# EAGLE design lightsaber (EAGLE 9.6.2)
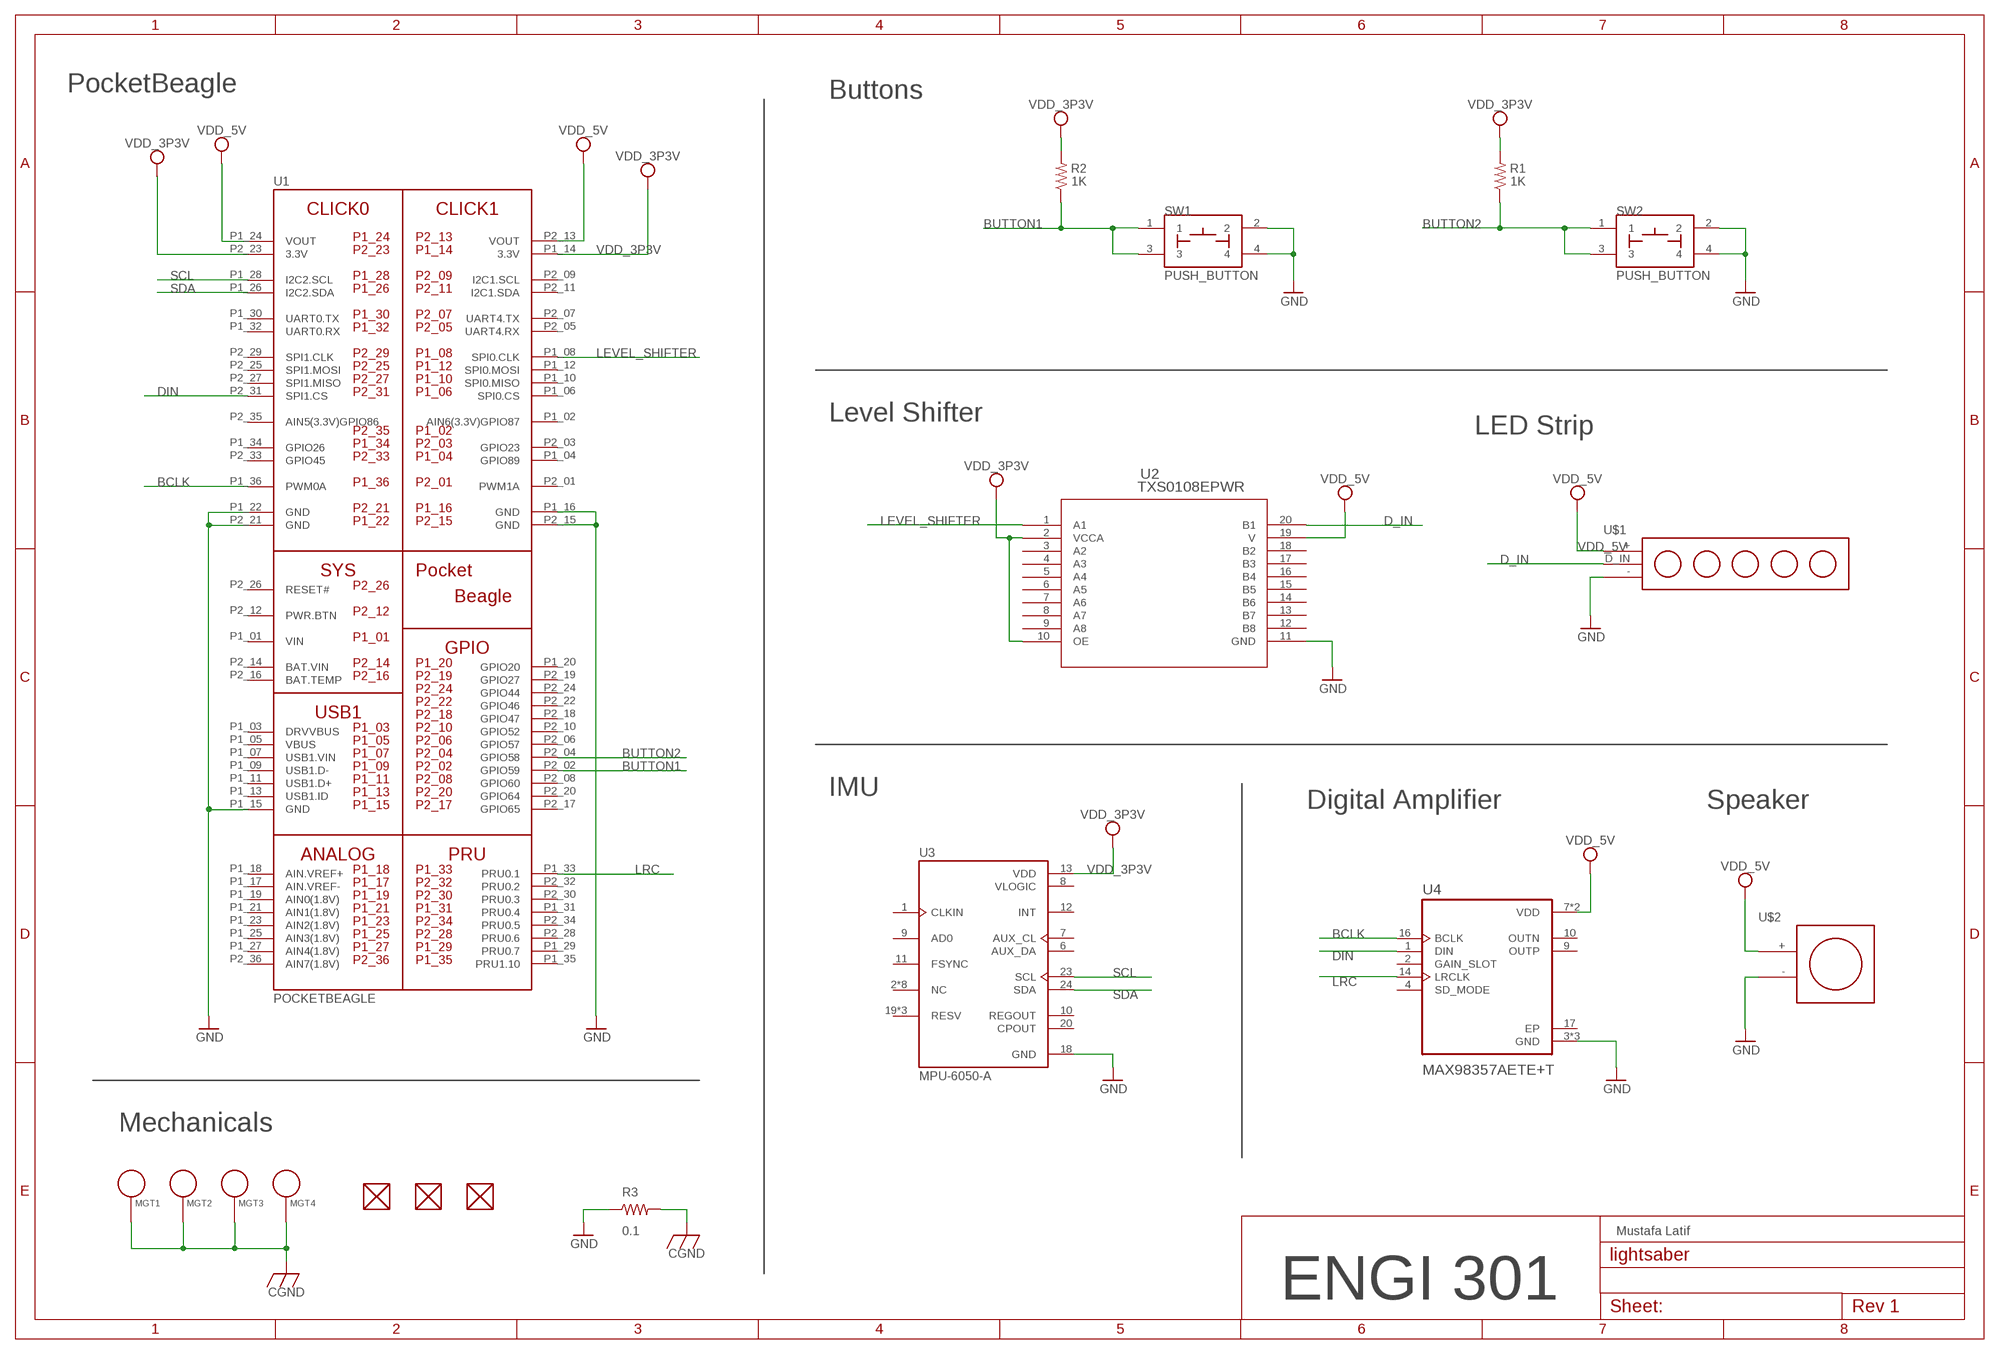
[diagram p0: schematic, sheet 1]

## Parts
FUD1  FIDUCIAL  [FIDUCIAL_40MIL]
FUD2  FIDUCIAL  [FIDUCIAL_40MIL]
FUD3  FIDUCIAL  [FIDUCIAL_40MIL]
MGT1  MOUNTING_HOLE  [MOUNTING_HOLE]
MGT2  MOUNTING_HOLE  [MOUNTING_HOLE]
MGT3  MOUNTING_HOLE  [MOUNTING_HOLE]
MGT4  MOUNTING_HOLE  [MOUNTING_HOLE]
R1  1K  R_R0603  [R0603]
R2  1K  R_R0603  [R0603]
R3  0.1  R_R0805  [R0805]
SW1  PUSH_BUTTON  [BUTTON_12.5MM]
SW2  PUSH_BUTTON  [BUTTON_12.5MM]
U1  POCKETBEAGLE  [POCKETBEAGLE]
U2  TXS0108EPWR  [PW20]
U3  MPU-6050-A  [QFN50P400X400X95-24N]
U4  MAX98357AETE+T  [QFN50P300X300X80-17N]
U$1  LED_LIGHT_STRIP  [LED_LIGHT_STRIP]
U$2  SPEAKER  [SPEAKER]

## Nets
BCLK: U1.P1_36(PWM0A) U4.16(BCLK)
BUTTON1: R2.1 SW1.1 SW1.3 U1.P2_02(GPIO59)
BUTTON2: R1.1 SW2.1 SW2.3 U1.P2_04(GPIO58)
CGND: MGT1.P$1 MGT2.P$1 MGT3.P$1 MGT4.P$1 R3.2
D_IN: U2.20(B1) U$1.D_IN
DIN: U1.P2_31(SPI1.CS) U4.1(DIN)
GND: R3.1 SW1.2 SW1.4 SW2.2 SW2.4 U1.P1_15(GND) U1.P1_16(GND) U1.P1_22(GND) U1.P2_15(GND) U1.P2_21(GND) U2.11(GND) U3.18(GND) U4.3(GND) U4.11(GND) U4.15(GND) U$1.-(GND) U$2.-
LEVEL_SHIFTER: U1.P1_08(SPI0.CLK) U2.1(A1)
LRC: U1.P1_33(PRU0.1) U4.14(LRCLK)
SCL: U1.P1_28(I2C2.SCL) U3.23(SCL)
SDA: U1.P1_26(I2C2.SDA) U3.24(SDA)
VDD_3P3V: R1.2 R2.2 U1.P1_14(3.3V) U1.P2_23(3.3V) U2.2(VCCA) U2.10(OE) U3.13(VDD)
VDD_5V: U1.P1_24(VOUT) U1.P2_13(VOUT) U2.19(V) U4.7(VDD) U4.8(VDD) U$1.+(+5V) U$2.+
Unconnected: FUD1.P$1 FUD2.P$1 FUD3.P$1 U1.P1_02(AIN6(3.3V)GPIO87) U1.P1_03(DRVVBUS) U1.P1_04(GPIO89) U1.P1_05(VBUS) U1.P1_06(SPI0.CS) U1.P1_07(USB1.VIN) U1.P1_09(USB1.D-) U1.P1_10(SPI0.MISO) U1.P1_11(USB1.D+) U1.P1_12(SPI0.MOSI) U1.P1_13(USB1.ID) U1.P1_17(AIN.VREF-) U1.P1_18(AIN.VREF+) U1.P1_19(AIN0(1.8V)) U1.P1_20(GPIO20) U1.P1_21(AIN1(1.8V)) U1.P1_23(AIN2(1.8V)) U1.P1_25(AIN3(1.8V)) U1.P1_27(AIN4(1.8V)) U1.P1_29(PRU0.7) U1.P1_30(UART0.TX) U1.P1_31(PRU0.4) U1.P1_32(UART0.RX) U1.P1_34(GPIO26) U1.P1_35(PRU1.10) U1.P2_01(PWM1A) U1.P2_03(GPIO23) U1.P2_05(UART4.RX) U1.P2_06(GPIO57) U1.P2_07(UART4.TX) U1.P2_08(GPIO60) U1.P2_09(I2C1.SCL) U1.P2_10(GPIO52) U1.P2_11(I2C1.SDA) U1.P2_12(PWR.BTN) U1.P2_16(BAT.TEMP) U1.P2_17(GPIO65) U1.P2_18(GPIO47) U1.P2_19(GPIO27) U1.P2_20(GPIO64) U1.P2_22(GPIO46) U1.P2_24(GPIO44) U1.P2_25(SPI1.MOSI) U1.P2_26(RESET#) U1.P2_27(SPI1.MISO) U1.P2_28(PRU0.6) U1.P2_29(SPI1.CLK) U1.P2_30(PRU0.3) U1.P2_32(PRU0.2) U1.P2_33(GPIO45) U1.P2_34(PRU0.5) U1.P2_35(AIN5(3.3V)GPIO86) U1.P2_36(AIN7(1.8V)) U2.3(A2) U2.4(A3) U2.5(A4) U2.6(A5) U2.7(A6) U2.8(A7) U2.9(A8) U2.12(B8) U2.13(B7) U2.14(B6) U2.15(B5) U2.16(B4) U2.17(B3) U2.18(B2) U3.1(CLKIN) U3.2(NC) U3.3(NC) U3.4(NC) U3.5(NC) U3.6(AUX_DA) U3.7(AUX_CL) U3.9(AD0) U3.10(REGOUT) U3.11(FSYNC) U3.12(INT) U3.14(NC) U3.15(NC) U3.16(NC) U3.17(NC) U3.19(RESV) U3.20(CPOUT) U3.21(RESV) U3.22(RESV) U4.2(GAIN_SLOT) U4.4(SD_MODE) U4.9(OUTP) U4.10(OUTN)

## Notes on the sheet
- PocketBeagle
- Buttons
- Level Shifter
- LED Strip
- IMU
- Digital Amplifier | Speaker
- Mechanicals
- Mustafa Latif
- ENGI 301

## Power pins joined to a net without a drawn wire
BAT.VIN: U1.P2_14(BAT.VIN)
EP: U4.17(EP)
VIN: U1.P1_01(VIN)
VLOGIC: U3.8(VLOGIC)

## Library data of the parts
FUD1-FUD3 = Lightsaber:FIDUCIAL
MGT1-MGT4 = Lightsaber:MOUNTING_HOLE: Chassis Mounting Hole w/GND connection ability
R1-R3 = Lightsaber:R_: RESISTOR, American symbol
SW1 SW2 = Lightsaber:PUSH_BUTTON
U1 = Lightsaber:POCKETBEAGLE
U2 = Lightsaber:TXS0108EPWR; COPYRIGHT: Copyright (C) 2024 Ultra Librarian. All rights reserved.; MANUFACTURER_PART_NUMBER: TXS0108EPWR; MFR_NAME: Texas Instruments
U3 = Lightsaber:MPU-6050-A: Check availability <https://pricing.snapeda.com/parts/MPU-6050-A/TDK%20InvenSense/view-part?ref=eda>; AVAILABILITY: In Stock; CHECK_PRICES: https://www.snapeda.com/parts/MPU-6050-A/TDK/view-part/?ref=eda; DESCRIPTION: MOTION TRACKING DEVICE; MF: TDK InvenSense; MP: MPU-6050-A; PACKAGE: QFN-24 InvenSense; PRICE: None; SNAPEDA_LINK: https://www.snapeda.com/parts/MPU-6050-A/TDK/view-part/?ref=snap
U4 = Lightsaber:MAX98357AETE+T: None Check availability <https://pricing.snapeda.com/parts/MAX98357AETE%2BT/Analog%20Devices/view-part?ref=eda>; AVAILABILITY: In Stock; CHECK_PRICES: https://www.snapeda.com/parts/MAX98357AETE+T/Analog+Devices/view-part/?ref=eda; DESCRIPTION: Tiny, Low-Cost, PCM Class D Amplifier with Class AB Performance; MF: Analog Devices; MP: MAX98357AETE+T; PACKAGE: TQFN-16 Maxim; PRICE: None; SNAPEDA_LINK: https://www.snapeda.com/parts/MAX98357AETE+T/Analog+Devices/view-part/?ref=snap
U$1 = Lightsaber:LED_LIGHT_STRIP
U$2 = Lightsaber:SPEAKER

## Board
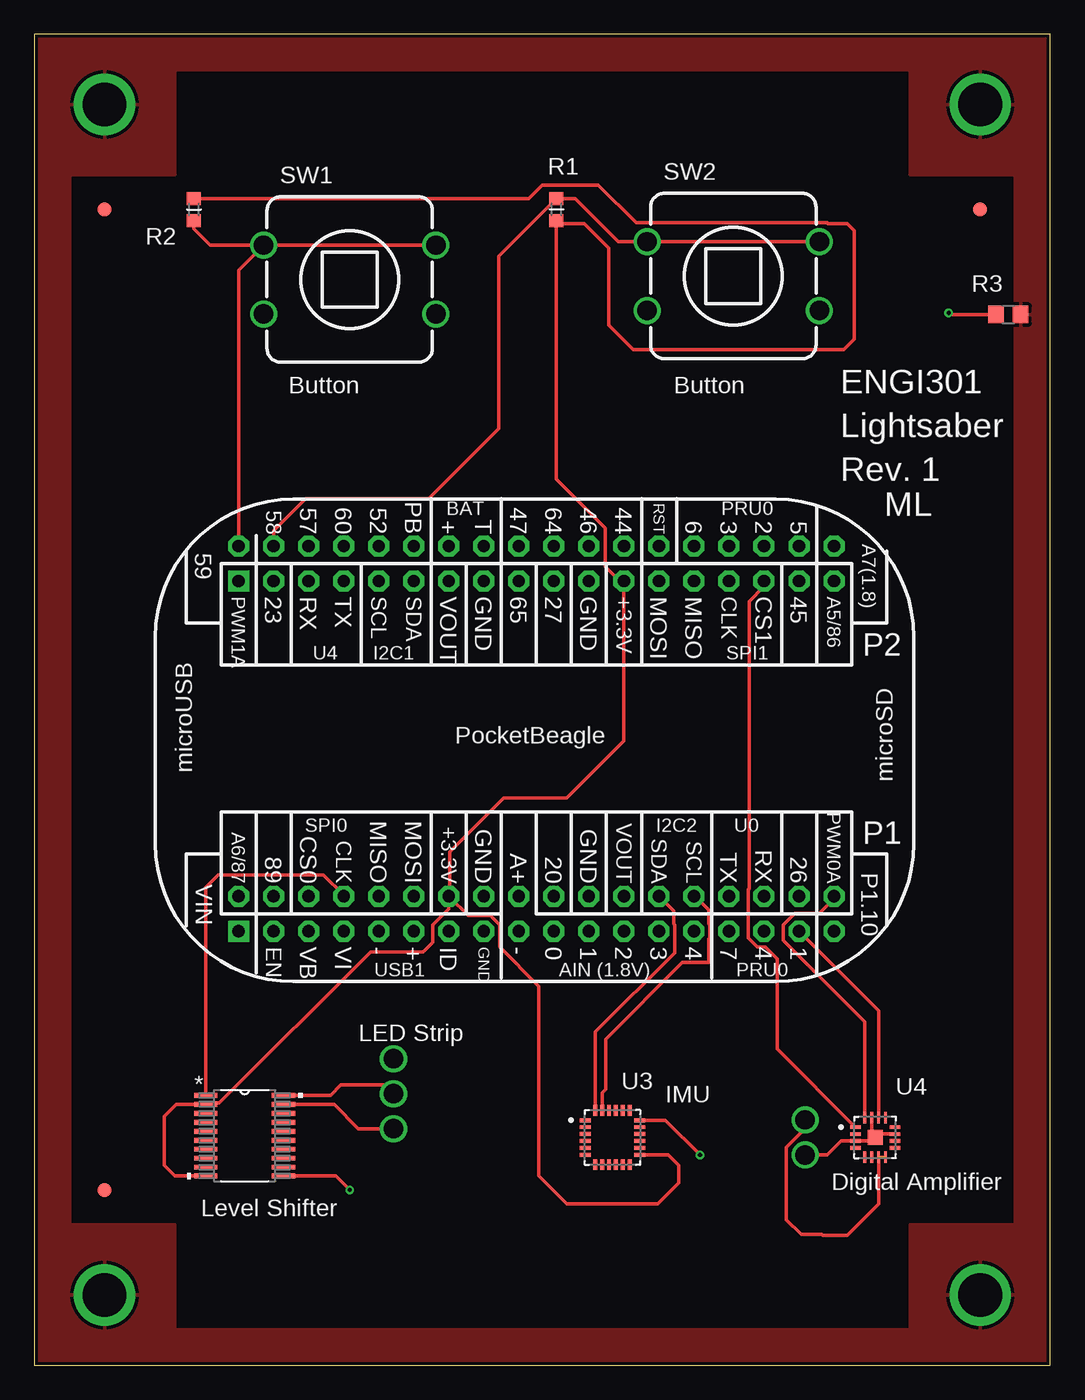
[diagram p1: board, top side]
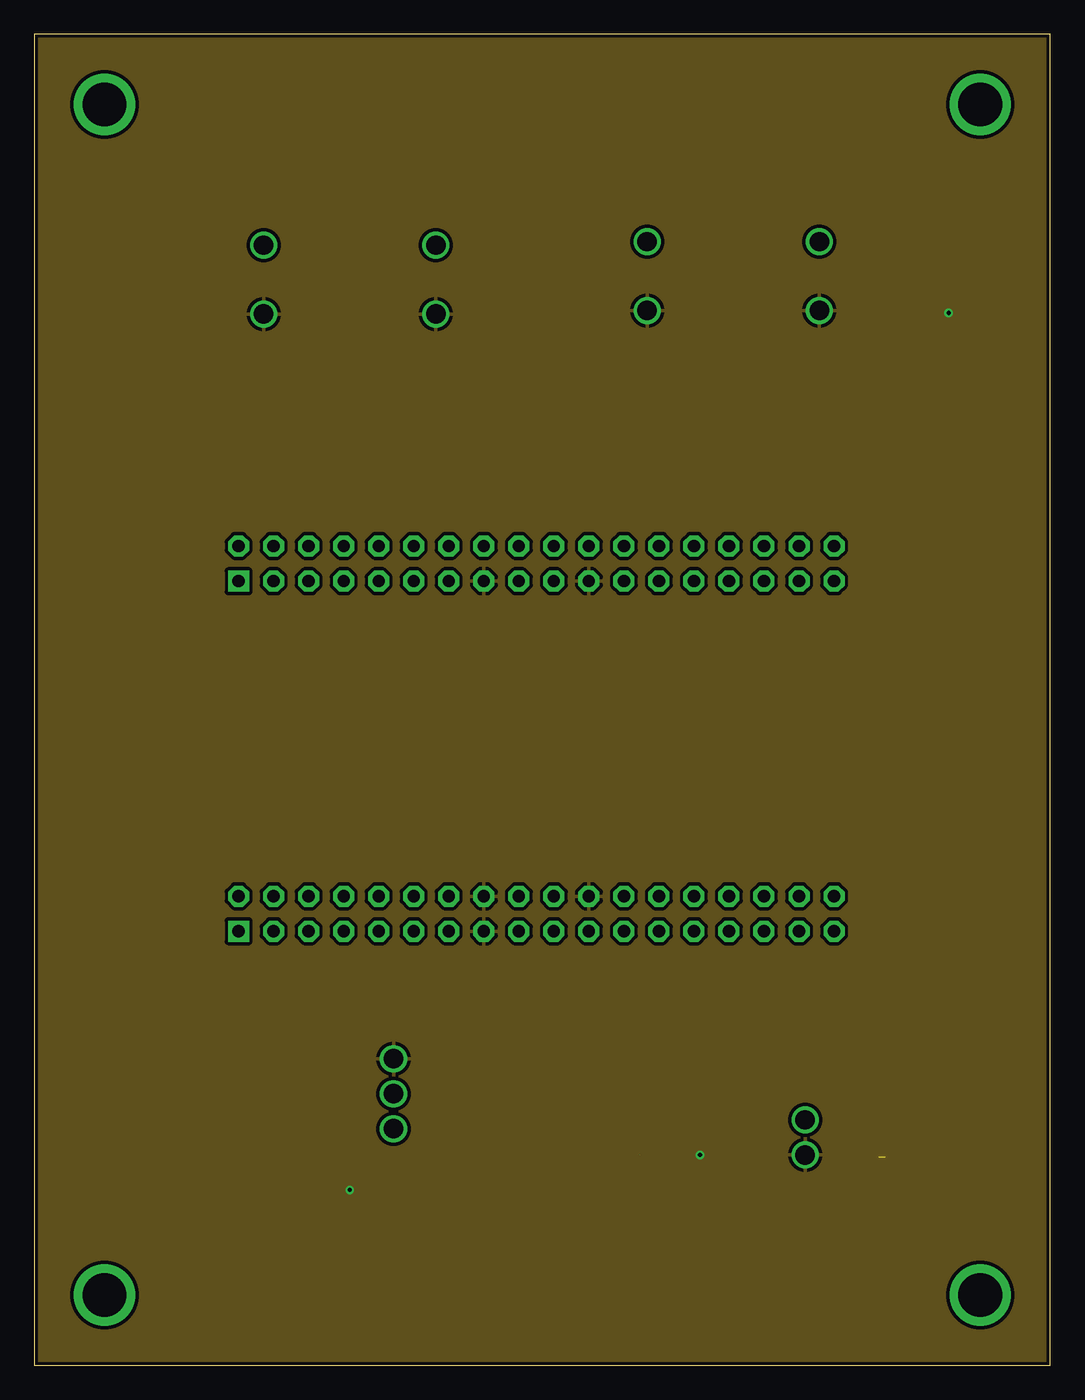
[diagram p2: board, inner layer Route2]
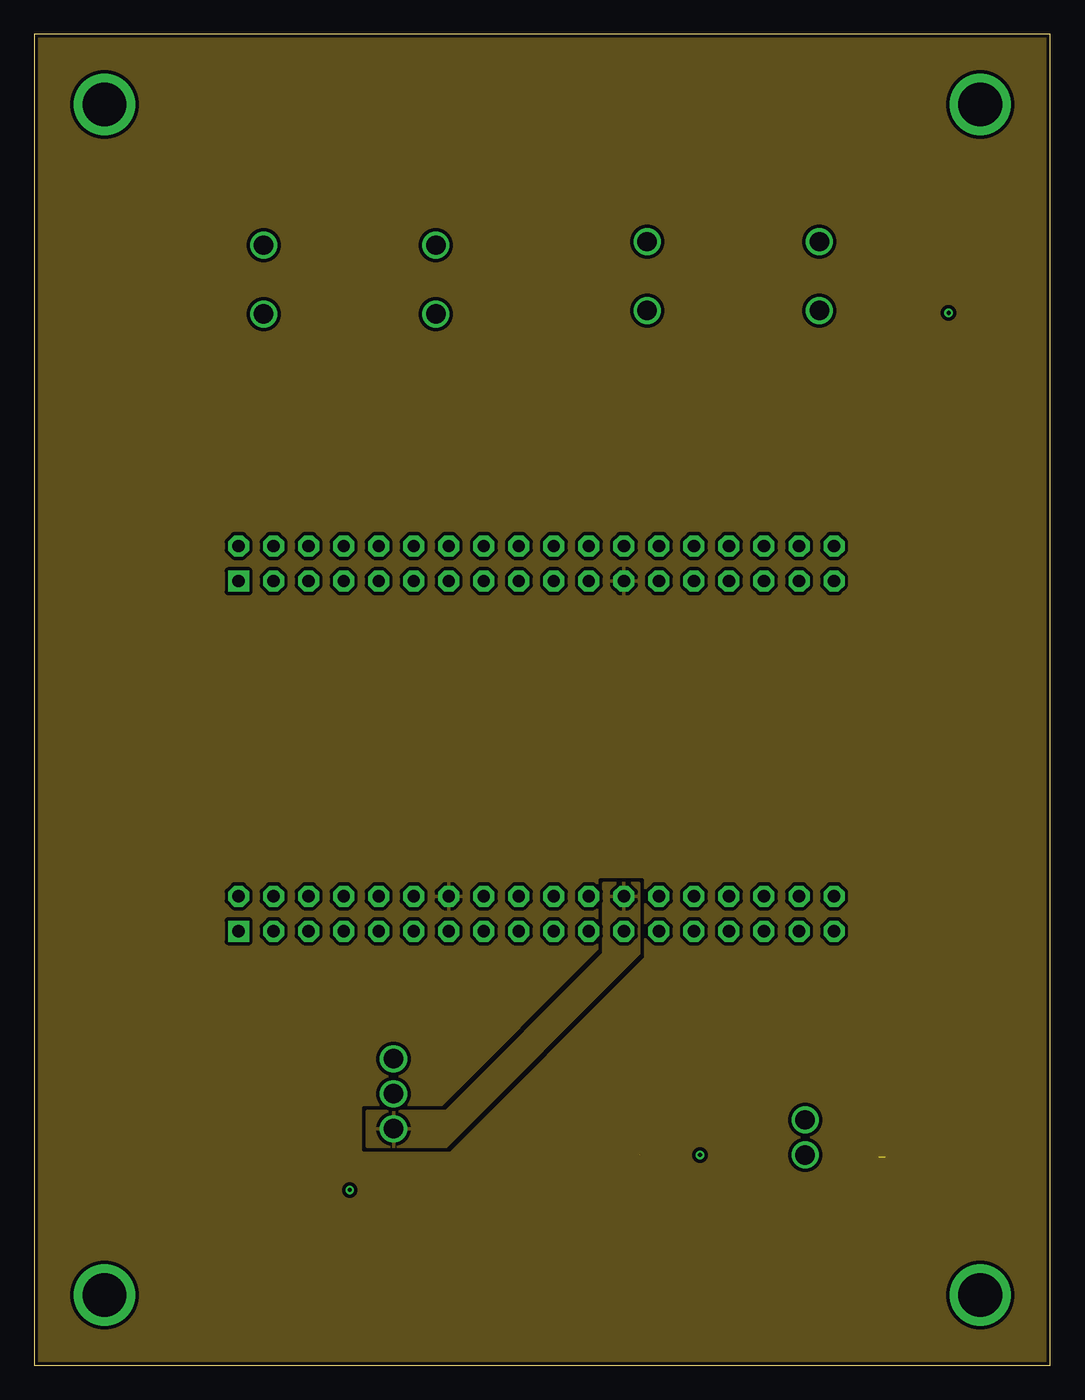
[diagram p3: board, inner layer Route15]
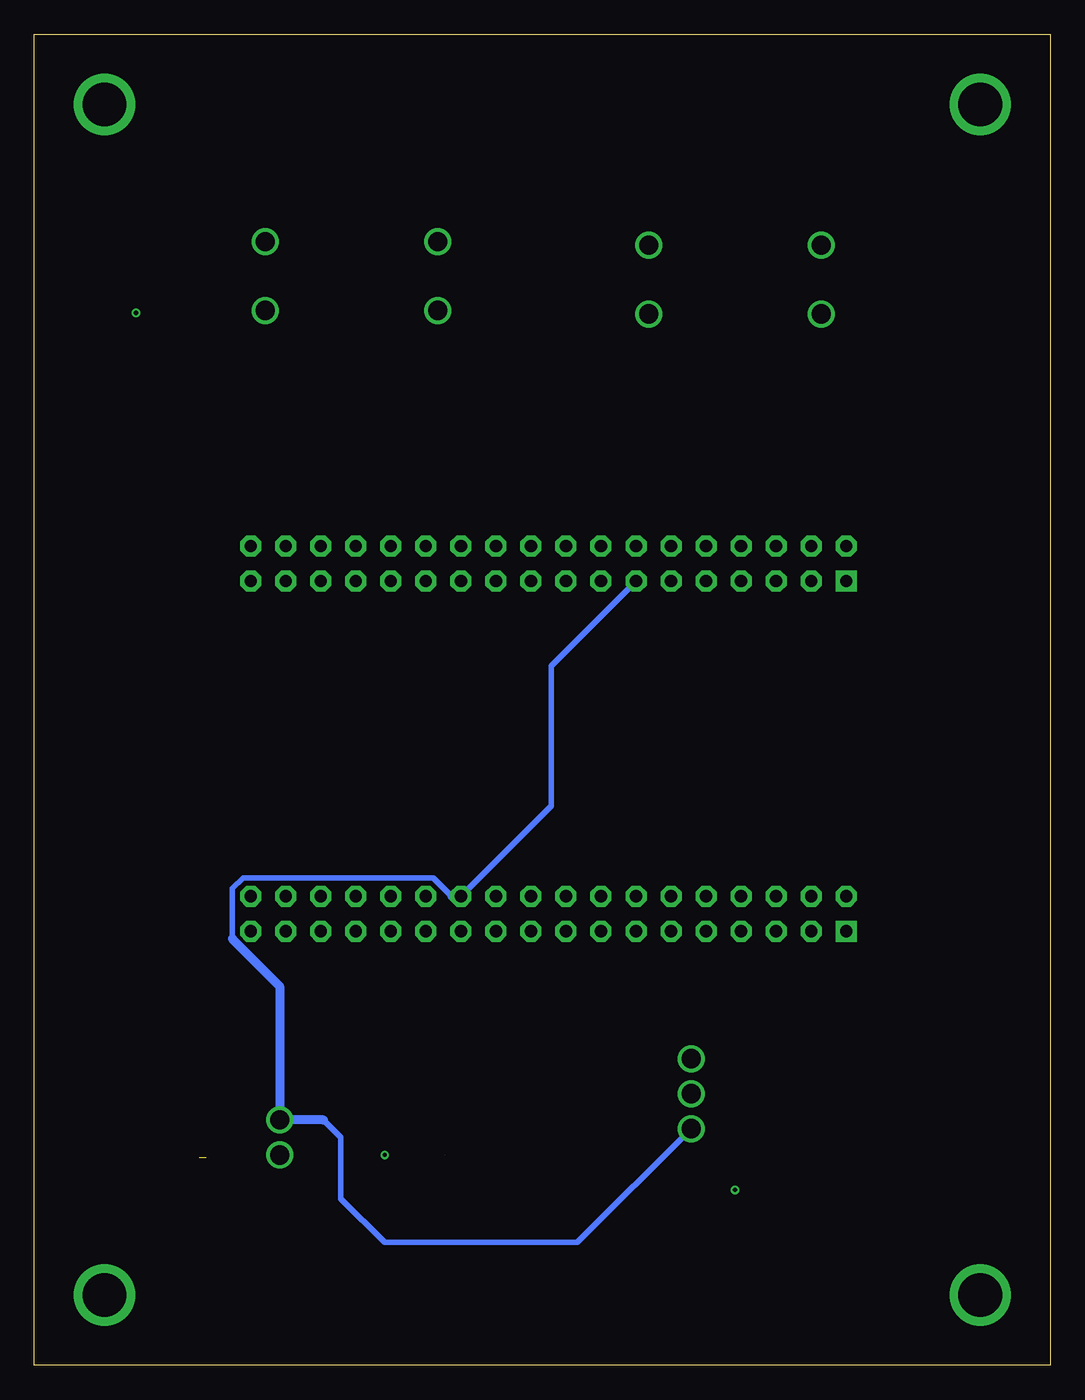
[diagram p4: board, bottom side, seen from below]

Size 73.66 x 96.52 mm. Coordinates in mm from the lower left corner, seen from the top.
Outline: 0,0 73.66,0 73.66,96.52 0,96.52 0,0
Copper layers (1*2*15*16): Top 0.035mm / dielectric 0.23mm / Route2 0.035mm / dielectric 0.93mm / Route15 0.035mm / dielectric 0.23mm / Bottom 0.035mm
Design rules "EDES301_4lyr": minimum track width 10mil, minimum drill 12mil, track to track 10mil, track to pad 10mil, pad to pad 10mil, via to via 10mil, smd to smd 10mil, copper to edge 10mil, drill to drill 12mil, minimum pad ring 6mil, minimum via ring 6mil, stop-mask expansion 3mil, vias tented up to drill 25mil, thermal gap 10mil

### Footprints (pad centres in the part's own frame; a part is rotated, then mirrored left to right if it is on the bottom)
FIDUCIAL_40MIL = smd 1.016 x 1.016: P$1 0,0
MOUNTING_HOLE = drill 3.175 pad 4.445: P$1 0,0
R0603 = smd 0.95 x 1.031: 1 -0.8,0; 2 0.8,0
R0805 = smd 1.143 x 1.27: 1 -0.889,0; 2 0.889,0
BUTTON_12.5MM = drill 1.4: 1 -6.25,2.5; 2 -6.25,-2.5; 3 6.25,2.5; 4 6.25,-2.5
POCKETBEAGLE = drill 0.889 pad 1.524 square: P1_01 5.91,3.53; P2_01 5.91,28.93 | drill 0.889 pad 1.524 octagon: P1_02 5.91,6.07; P1_03 8.45,3.53; P1_04 8.45,6.07; P1_05 10.99,3.53; P1_06 10.99,6.07; P1_07 13.53,3.53; P1_08 13.53,6.07; P1_09 16.07,3.53; P1_10 16.07,6.07; P1_11 18.61,3.53; P1_12 18.61,6.07; P1_13 21.15,3.53; P1_14 21.15,6.07; P1_15 23.69,3.53; P1_16 23.69,6.07; P1_17 26.23,3.53; P1_18 26.23,6.07; P1_19 28.77,3.53; P1_20 28.77,6.07; P1_21 31.31,3.53; P1_22 31.31,6.07; P1_23 33.85,3.53; P1_24 33.85,6.07; P1_25 36.39,3.53; P1_26 36.39,6.07; P1_27 38.93,3.53; P1_28 38.93,6.07; P1_29 41.47,3.53; P1_30 41.47,6.07; P1_31 44.01,3.53; P1_32 44.01,6.07; P1_33 46.55,3.53; P1_34 46.55,6.07; P1_35 49.09,3.53; P1_36 49.09,6.07; P2_02 5.91,31.47; P2_03 8.45,28.93; P2_04 8.45,31.47; P2_05 10.99,28.93; P2_06 10.99,31.47; P2_07 13.53,28.93; P2_08 13.53,31.47; P2_09 16.07,28.93; P2_10 16.07,31.47; P2_11 18.61,28.93; P2_12 18.61,31.47; P2_13 21.15,28.93; P2_14 21.15,31.47; P2_15 23.69,28.93; P2_16 23.69,31.47; P2_17 26.23,28.93; P2_18 26.23,31.47; P2_19 28.77,28.93; P2_20 28.77,31.47; P2_21 31.31,28.93; P2_22 31.31,31.47; P2_23 33.85,28.93; P2_24 33.85,31.47; P2_25 36.39,28.93; P2_26 36.39,31.47; P2_27 38.93,28.93; P2_28 38.93,31.47; P2_29 41.47,28.93; P2_30 41.47,31.47; P2_31 44.01,28.93; P2_32 44.01,31.47; P2_33 46.55,28.93; P2_34 46.55,31.47; P2_35 49.09,28.93; P2_36 49.09,31.47
PW20 = smd 1.676 x 0.356: 1 -2.819,2.925; 2 -2.819,2.275; 3 -2.819,1.625; 4 -2.819,0.975; 5 -2.819,0.325; 6 -2.819,-0.325; 7 -2.819,-0.975; 8 -2.819,-1.625; 9 -2.819,-2.275; 10 -2.819,-2.925; 11 2.819,-2.925; 12 2.819,-2.275; 13 2.819,-1.625; 14 2.819,-0.975; 15 2.819,-0.325; 16 2.819,0.325; 17 2.819,0.975; 18 2.819,1.625; 19 2.819,2.275; 20 2.819,2.925
QFN50P400X400X95-24N = smd 0.79 x 0.28: 1 -1.97,1.25; 2 -1.97,0.75; 3 -1.97,0.25; 4 -1.97,-0.25; 5 -1.97,-0.75; 6 -1.97,-1.25; 13 1.97,-1.25; 14 1.97,-0.75; 15 1.97,-0.25; 16 1.97,0.25; 17 1.97,0.75; 18 1.97,1.25 | smd 0.28 x 0.79: 7 -1.25,-1.97; 8 -0.75,-1.97; 9 -0.25,-1.97; 10 0.25,-1.97; 11 0.75,-1.97; 12 1.25,-1.97; 19 1.25,1.97; 20 0.75,1.97; 21 0.25,1.97; 22 -0.25,1.97; 23 -0.75,1.97; 24 -1.25,1.97
QFN50P300X300X80-17N = smd 0.84 x 0.27: 1 -1.435,0.75; 2 -1.435,0.25; 3 -1.435,-0.25; 4 -1.435,-0.75; 9 1.435,-0.75; 10 1.435,-0.25; 11 1.435,0.25; 12 1.435,0.75 | smd 0.27 x 0.84: 5 -0.75,-1.435; 6 -0.25,-1.435; 7 0.25,-1.435; 8 0.75,-1.435; 13 0.75,1.435; 14 0.25,1.435; 15 -0.25,1.435; 16 -0.75,1.435 | smd 1.1 x 1.1: 17 0,0
LED_LIGHT_STRIP = drill 1.4: + 0,2.54; - 0,-2.54; D_IN 0,0
SPEAKER = drill 1.4: + 0,0; - 0,-2.54

### Placement (x,y rotation side)
FUD1  5.08,12.7 0 top
FUD2  5.08,83.82 0 top
FUD3  68.58,83.82 0 top
MGT1  5.08,5.08 0 top
MGT2  5.08,91.44 0 top
MGT3  68.58,91.44 0 top
MGT4  68.58,5.08 0 top
R1  37.85,83.82 270 top
R2  11.56,83.82 90 top
R3  70.61,76.2 0 top
SW1  22.86,78.74 0 top
SW2  50.67,78.99 0 top
U1  8.89,27.94 0 top
U2  15.24,16.64 0 top
U3  41.91,16.51 0 top
U4  60.96,16.51 0 top
U$1  26.04,19.68 180 top
U$2  55.88,17.78 0 top

### Tracks (layer width: path | path; a pad name or v marks a point on that pad's centre or on a via)
BCLK
  Top 0.254: U4.16 60.21,24.88 54.3,30.79 54.3,31.94 54.36,32 55.12,32.77 56.9,32.77 57.98,33.85 U1.P1_36
BUTTON1
  Top 0.254: R2.1 11.56,82.42 12.74,81.24 SW1.1 | SW1.1 SW1.3 | SW1.1 14.8,79.43 U1.P2_02
BUTTON2
  Top 0.254: SW2.3 SW2.1 42.33,81.49 39.2,84.62 R1.1 33.66,80.43 33.66,67.94 28.57,62.87 19.68,62.87 17.34,60.52 U1.P2_04
CGND
  pour Top: 38.1,-2.54 38.1,2.54 63.5,2.54 63.5,10.16 71.12,10.16 71.12,86.36 63.5,86.36 63.5,93.98 38.1,93.98 38.1,99.06 76.2,99.06 76.2,-2.54
  pour Top: 38.1,99.06 38.1,93.98 10.16,93.98 10.16,86.36 2.54,86.36 2.54,10.16 10.16,10.16 10.16,2.54 38.1,2.54 38.1,-2.54 -2.54,-2.54 -2.54,99.06
D_IN
  Top 0.254: U2.20 21.47,19.56 22.23,20.32 25.4,20.32 U$1.D_IN
DIN
  Top 0.254: U4.1 53.85,22.94 53.85,29.46 52.98,30.33 52.43,30.33 51.76,31 51.76,34.48 51.82,34.54 51.82,55.37 52.9,56.46 U1.P2_31
GND  (via drill 0.3 pad 0.61)
  Top 0.254: R3.1 66.42,76.2 v66.29,76.33 | U3.18 45.74,17.76 v48.26,15.24 | U2.11 21.85,13.71 v22.86,12.7 | U$2.- 57.49,15.24 58.51,16.26 U4.3 60.7,16.26 60.71,16.26 60.71,16.76 | 60.71,16.76 U4.15 | U4.11 60.71,16.76
  pour Route2: -5.08,101.6 78.74,101.6 78.74,-5.08 -5.08,-5.08
LEVEL_SHIFTER
  Top 0.254: U2.1 12.42,34.65 13.34,35.56 20.95,35.56 22.42,34.09 U1.P1_08
LRC
  Top 0.254: U4.14 61.21,25.7 U1.P1_33
SCL
  Top 0.254: U3.23 41.16,19.75 41.41,20 41.41,23.63 46.99,29.21 48.9,29.21 48.9,30.93 48.96,31 48.96,31.94 48.9,32.01 48.9,33.02 47.91,34.01 U1.P1_28
SDA
  Top 0.254: U3.24 40.66,24.15 46.42,29.91 46.42,31.94 46.35,32.01 46.35,32.94 U1.P1_26
VDD_3P3V  (1 unrouted)
  Top 0.254: 38.1,82.77 38.08,82.78 | 38.08,82.78 R1.2 37.85,64.26 41.4,60.71 41.4,57.91 42.44,56.87 U1.P2_23 42.74,45.28 38.61,41.15 34.04,41.15 30.12,37.23 30.12,33.93 | U2.10 10.16,13.71 9.4,14.48 9.4,18.03 10.28,18.91 U2.2 12.51,19 13.42,19 24.39,29.97 28.19,29.97 28.9,30.68 28.9,31.94 30.04,33.09 U1.P1_14 30.12,33.93 | 30.12,33.93 31.44,32.61 33.05,32.61 33.72,31.94 33.72,30.33 36.58,27.47 36.58,13.72 38.61,11.68 45.21,11.68 46.74,13.21 46.74,14.48 45.97,15.24 44.43,15.24 43.88,15.24 | R2.2 35.85,84.62 36.83,85.6 40.89,85.6 43.64,82.86 57.49,82.86 57.54,82.8 58.93,82.8 59.44,82.3 59.44,74.42 58.67,73.66 43.43,73.66 41.66,75.44 41.66,81.03 39.88,82.8 38.1,82.8 38.08,82.78
  pour Route15 (rank 6): -7.62,104.14 81.28,104.14 81.28,-7.62 -7.62,-7.62
VDD_5V  (1 unrouted)
  Top 0.254: U2.19 21.73,18.91 23.5,17.14 U$1.+ | U$2.+ 55.88,17.16 54.52,15.8 54.52,10.55 55.6,9.47 57.07,9.47 57.15,9.4 58.93,9.4 61.23,11.7 61.23,15.07 U4.8
  Bottom 0.381: U1.P2_13 36.2,50.72 36.2,40.55 U1.P1_24 | U$1.+ 34.29,8.89 48.26,8.89 51.44,12.06 51.44,16.51 52.7,17.78 | 59.31,30.92 59.31,34.56 58.53,35.34 44.73,35.34 43.39,34.01
  Bottom 0.635: 52.7,17.78 U$2.+ 55.88,27.48 59.31,30.92 | U1.P1_24 43.39,34.01
  pour Route15: 43.81,34.92 43.81,29.84 29.84,15.88 24.13,15.88 24.13,18.41 29.84,18.41 41.27,29.84 41.27,34.92

### Text on the board
tPlace: Button | Button | ENGI301 | Lightsaber | Rev. 1 | ML | LED Strip | IMU | Digital Amplifier | Level Shifter